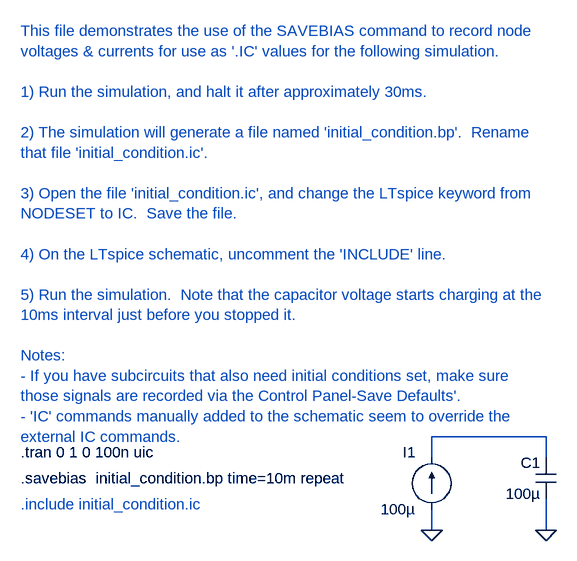
[diagram p0: schematic SavebiasInitialConditionTestCircuit.asc]
SavebiasInitialConditionTestCircuit.asc, the LTspice schematic file:
Version 4
SHEET 1 1112 680
WIRE 64 208 64 176
WIRE 64 320 64 288
WIRE 240 176 64 176
WIRE 240 208 240 176
WIRE 240 320 240 272
FLAG 64 320 0
FLAG 240 320 0
SYMBOL current 64 288 R180
WINDOW 0 24 88 Left 0
WINDOW 3 24 0 Left 0
SYMATTR InstName I1
SYMATTR Value 100µ
SYMBOL cap 256 208 M0
SYMATTR InstName C1
SYMATTR Value 100µ
TEXT -568 240 Left 0 !.savebias  initial_condition.bp time=10m repeat
TEXT -568 200 Left 0 !.tran 0 1 0 100n uic
TEXT -568 280 Left 0 ;.include initial_condition.ic
TEXT -568 -448 Left 0 ;This file demonstrates the use of the SAVEBIAS command to record node \nvoltages & currents for use as '.IC' values for the following simulation.\n \n1) Run the simulation, and halt it after approximately 30ms.\n \n2) The simulation will generate a file named 'initial_condition.bp'.  Rename \nthat file 'initial_condition.ic'.\n \n3) Open the file 'initial_condition.ic', and change the LTspice keyword from\nNODESET to IC.  Save the file.\n \n4) On the LTspice schematic, uncomment the 'INCLUDE' line.\n \n5) Run the simulation.  Note that the capacitor voltage starts charging at the\n10ms interval just before you stopped it.\n \nNotes:\n- If you have subcircuits that also need initial conditions set, make sure \nthose signals are recorded via the Control Panel-Save Defaults'.\n- 'IC' commands manually added to the schematic seem to override the \nexternal IC commands.

The netlist it stands for:
* SavebiasInitialConditionTestCircuit.asc
I1 0 N001 100µ
C1 N001 0 100µ
.savebias  initial_condition.bp time=10m repeat
.tran 0 1 0 100n uic
* .include initial_condition.ic
* This file demonstrates the use of the SAVEBIAS command to record node
* voltages & currents for use as '.IC' values for the following simulation.
* 1) Run the simulation, and halt it after approximately 30ms.
* 2) The simulation will generate a file named 'initial_condition.bp'.  Rename
* that file 'initial_condition.ic'.
* 3) Open the file 'initial_condition.ic', and change the LTspice keyword from
* NODESET to IC.  Save the file.
* 4) On the LTspice schematic, uncomment the 'INCLUDE' line.
* 5) Run the simulation.  Note that the capacitor voltage starts charging at the
* 10ms interval just before you stopped it.
* Notes:
* - If you have subcircuits that also need initial conditions set, make sure
* those signals are recorded via the Control Panel-Save Defaults'.
* - 'IC' commands manually added to the schematic seem to override the
* external IC commands.
.backanno
.end